# Altium project Dev_Brd_ATSAML10D16A.PrjPcb
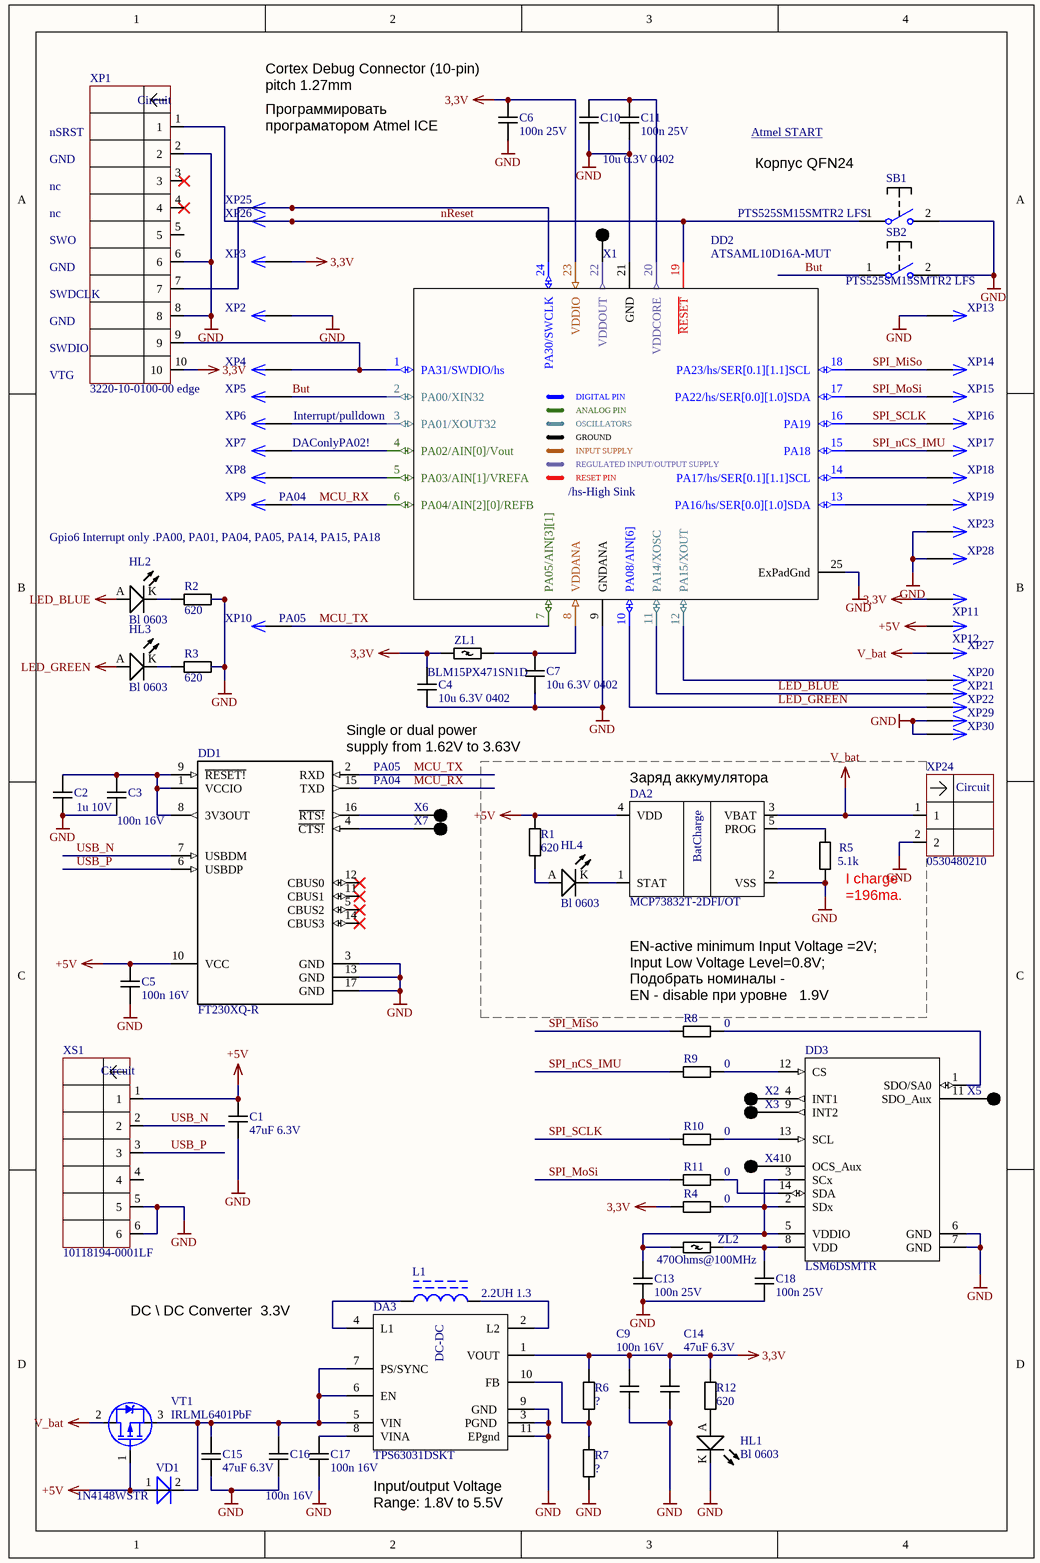
[diagram p0: Dev_Brd_ATSAML10D16A.SchDoc]
1 sheet, 82 parts. Net scope: global (net labels, ports and power ports of the same name join across sheets).
Board files: Dev_Brd_ATSAML10D16A.PcbDoc, Dev_Brd_ATSAML10D16A_HandMade.PcbDoc

## Sheet Dev_Brd_ATSAML10D16A.SchDoc
size A4 portrait; SheetNumber: 1; SheetTotal: 1

### Parts
C1  47uF 6.3V  [CapKemet1005(0402)]
C2  1u 10V  [CapKemet1005(0402)]
C3  100n 16V  [CapKemet1005(0402)]
C4  10u 6.3V 0402  [CapKemet1005(0402)]
C5  100n 16V  [CapKemet1005(0402)]
C6  100n 25V  [CapKemet1005(0402)]
C7  10u 6.3V 0402  [CapKemet1005(0402)]
C9  100n 16V  [CapKemet1005(0402)]
C10  10u 6.3V 0402  [CapKemet1005(0402)]
C11  100n 25V  [CapKemet1005(0402)]
C13  100n 25V  [CapKemet1005(0402)]
C14  47uF 6.3V  [CapKemet1005(0402)]
C15  47uF 6.3V  [CapKemet1005(0402)]
C16  100n 16V  [CapKemet1005(0402)]
C17  100n 16V  [CapKemet1005(0402)]
C18  100n 25V  [CapKemet1005(0402)]
DA2  MCP73832T-2DFI/OT  [SOT-23-5]
DA3  TPS63031DSKT  [WSON-10]
DD1  FT230XQ-R  [QFN-16(4x4)]
DD2  ATSAML10D16A-MUT  [VQFN-24]
DD3  LSM6DSMTR  [LGA-14L_2P5X3X0P83_STM-M]
HL1  Bl 0603  [LED-0603-BLUE]
HL2  Bl 0603  [LED-0603-BLUE]
HL3  Bl 0603  [LED-0603-BLUE]
HL4  Bl 0603  [LED-0603-BLUE]
L1  2.2UH 1.3  [CDRH2D11]
R1  620  [REZKemet 0402]
R2  620  [REZKemet 0402]
R3  620  [REZKemet 0402]
R4  0  [REZKemet 0402]
R5  5.1k  [REZKemet 0402]
R6  ?  [REZKemet 0402]
R7  ?  [REZKemet 0402]
R8  0  [REZKemet 0402]
R9  0  [REZKemet 0402]
R10  0  [REZKemet 0402]
R11  0  [REZKemet 0402]
R12  620  [REZKemet 0402]
SB1  PTS525SM15SMTR2 LFS  [TACT_SWITCH KPT1187B]
SB2  PTS525SM15SMTR2 LFS  [TACT_SWITCH KPT1187B]
VD1  1N4148WSTR  [SOD323]
VT1  IRLML6401PbF  [SOT23-3N]
X1  PLLS1.27-1-TOP-R  [PLLS1.27-1-TOP-R]  (value not drawn)
X2  PLLS1.27-1-TOP-R  [PLLS1.27-1-TOP-R]  (value not drawn)
X3  PLLS1.27-1-TOP-R  [PLLS1.27-1-TOP-R]  (value not drawn)
X4  PLLS1.27-1-TOP-R  [PLLS1.27-1-TOP-R]  (value not drawn)
X5  PLLS1.27-1-TOP-R  [PLLS1.27-1-TOP-R]  (value not drawn)
X6  PLLS1.27-1-TOP-R  [PLLS1.27-1-TOP-R]  (value not drawn)
X7  PLLS1.27-1-TOP-R  [PLLS1.27-1-TOP-R]  (value not drawn)
XP1  3220-10-0100-00 edge  [IPS 10(1.27)edge]
XP2  PLS-1  [PLS-1-3D]  (value not drawn)
XP3  PLS-1  [PLS-1-3D]  (value not drawn)
XP4  PLS-1  [PLS-1-3D]  (value not drawn)
XP5  PLS-1  [PLS-1-3D]  (value not drawn)
XP6  PLS-1  [PLS-1-3D]  (value not drawn)
XP7  PLS-1  [PLS-1-3D]  (value not drawn)
XP8  PLS-1  [PLS-1-3D]  (value not drawn)
XP9  PLS-1  [PLS-1-3D]  (value not drawn)
XP10  PLS-1  [PLS-1-3D]  (value not drawn)
XP11  PLS-1  [PLS-1-3D]  (value not drawn)
XP12  PLS-1  [PLS-1-3D]  (value not drawn)
XP13  PLS-1  [PLS-1-3D]  (value not drawn)
XP14  PLS-1  [PLS-1-3D]  (value not drawn)
XP15  PLS-1  [PLS-1-3D]  (value not drawn)
XP16  PLS-1  [PLS-1-3D]  (value not drawn)
XP17  PLS-1  [PLS-1-3D]  (value not drawn)
XP18  PLS-1  [PLS-1-3D]  (value not drawn)
XP19  PLS-1  [PLS-1-3D]  (value not drawn)
XP20  PLS-1  [PLS-1-3D]  (value not drawn)
XP21  PLS-1  [PLS-1-3D]  (value not drawn)
XP22  PLS-1  [PLS-1-3D]  (value not drawn)
XP23  PLS-1  [PLS-1-3D]  (value not drawn)
XP24  0530480210  [0530480210]
XP25  PLS-1  [PLS-1-3D]  (value not drawn)
XP26  PLS-1  [PLS-1-3D]  (value not drawn)
XP27  PLS-1  [PLS-1-3D]  (value not drawn)
XP28  PLS-1  [PLS-1-3D]  (value not drawn)
XP29  PLS-1  [PLS-1-3D]  (value not drawn)
XP30  PLS-1  [PLS-1-3D]  (value not drawn)
XS1  10118194-0001LF  [MICRO_USB _B]
ZL1  BLM15PX471SN1D  [Ferrite1005(0402)]
ZL2  470Ohms@100MHz  [Ferrite1005(0402)]

### Nets
3,3V: C4.2 C6.1 C9.2 C14.2 DA3.1(VOUT) DD2.23(VDDIO) R4.1 R6.2 R12.2 XP1.10 XP3.1 XP11.1 ZL1.1
+5V: C1.2 C5.2 DA2.4(VDD) DD1.10(VCC) R1.2 VD1.1 VT1.1(G) XP12.1 XS1.1
GND: C1.1 C2.1 C3.1 C4.1 C5.1 C6.2 C7.1 C9.1 C10.1 C11.2 C13.2 C14.1 C15.1 C16.1 C17.1 C18.2 DA2.2(VSS) DA3.3(PGND) DA3.9(GND) DA3.11(EPgnd) DD1.3(GND) DD1.13(GND) DD1.17(GND) DD2.9(GNDANA) DD2.21(GND) DD2.25(ExPadGnd) DD3.6(GND) DD3.7(GND) HL1.K R2.2 R3.2 R5.2 R7.1 SB1.2(NO) SB2.2(NO) XP1.2 XP1.6 XP1.8 XP2.1 XP13.1 XP23.1 XP24.2 XP28.1 XP29.1 XP30.1 XS1.5 XS1.6
LED_BLUE: DD2.11(PA14/XOSC) HL2.A XP21.1
LED_GREEN: DD2.10(PA08/AIN[6]) HL3.A XP22.1
V_bat: DA2.3(VBAT) VT1.2(D) XP24.1 XP27.1
But: DD2.2(PA00/XIN32) SB2.1(COMMON) XP5.1
MCU_RX: DD1.15(TXD) DD2.6(PA04/AIN[2][0]/REFB) XP9.1
MCU_TX: DD1.2(RXD) DD2.7(PA05/AIN[3][1]) XP10.1
nReset: DD2.19(~{RESET}) SB1.1(COMMON) XP1.1 XP26.1
SPI_MiSo: DD2.18(PA23/hs/SER[0.1][1.1]SCL) R8.1 XP14.1
SPI_MoSi: DD2.17(PA22/hs/SER[0.0][1.0]SDA) R11.1 XP15.1
SPI_nCS_IMU: DD2.15(PA18) R9.1 XP17.1
SPI_SCLK: DD2.16(PA19) R10.1 XP16.1
USB_N: DD1.7(USBDM) XS1.2
USB_P: DD1.6(USBDP) XS1.3
NetC2_2: C2.2 C3.2 DD1.1(VCCIO) DD1.8(3V3OUT) DD1.9(~{RESET!})
NetC7_2: C7.2 DD2.8(VDDANA) ZL1.2
NetC10_2: C10.2 C11.1 DD2.20(VDDCORE)
NetC13_1: C13.1 DD3.2(SDx) DD3.3(SCx) DD3.5(VDDIO) R4.2 ZL2.1
NetC15_2: C15.2 C16.2 DA3.5(VIN) DA3.6(EN) DA3.7(PS/SYNC) VD1.2 VT1.3(S)
NetC17_2: C17.2 DA3.8(VINA)
NetC18_1: C18.1 DD3.8(VDD) ZL2.2
NetDA2_1: DA2.1(STAT) HL4.K
NetDA2_5: DA2.5(PROG) R5.1
NetDA3_2: DA3.2(L2) L1.2
NetDA3_4: DA3.4(L1) L1.1
NetDA3_10: DA3.10(FB) R6.1 R7.2
NetDD1_4: DD1.4(~{CTS!}) X7.1
NetDD1_16: DD1.16(~{RTS!}) X6.1
NetDD2_1: DD2.1(PA31/SWDIO/hs) XP1.9 XP4.1
NetDD2_3: DD2.3(PA01/XOUT32) XP6.1
NetDD2_4: DD2.4(PA02/AIN[0]/Vout) XP7.1
NetDD2_5: DD2.5(PA03/AIN[1]/VREFA) XP8.1
NetDD2_12: DD2.12(PA15/XOUT) XP20.1
NetDD2_13: DD2.13(PA16/hs/SER[0.0][1.0]SDA) XP19.1
NetDD2_14: DD2.14(PA17/hs/SER[0.1][1.1]SCL) XP18.1
NetDD2_22: DD2.22(VDDOUT) X1.1
NetDD2_24: DD2.24(PA30/SWCLK) XP1.7 XP25.1
NetDD3_1: DD3.1(SDO/SA0) R8.2
NetDD3_4: DD3.4(INT1) X2.1
NetDD3_9: DD3.9(INT2) X3.1
NetDD3_10: DD3.10(OCS_Aux) X4.1
NetDD3_11: DD3.11(SDO_Aux) X5.1
NetDD3_12: DD3.12(CS) R9.2
NetDD3_13: DD3.13(SCL) R10.2
NetDD3_14: DD3.14(SDA) R11.2
NetHL1_A: HL1.A R12.1
NetHL2_K: HL2.K R2.1
NetHL3_K: HL3.K R3.1
NetHL4_A: HL4.A R1.1

Not connected (* = marked no-connect by the designer): DD1 5(CBUS2)* 11(CBUS1)* 12(CBUS0)* 14(CBUS3)*; XP1 3* 4* 5; XS1 4

### Notes on the sheet
- (near C6) Cortex Debug Connector (10-pin)
  pitch 1.27mm
- GND
- nSRST
- Программировать програматором Atmel ICE
- Atmel START <https://start.atmel.com/#dashboard>
- nc
- (near SB1) Корпус QFN24
- SWDCLK
- SWO
- SWDIO
- VTG
- Interrupt/pulldown
- PA04
- DAConlyPA02!
- (near DD2) Gpio6 Interrupt only .PA00, PA01, PA04, PA05, PA14, PA15, PA18
- (near XP10) PA05
- Single or dual power supply from 1.62V to 3.63V
- PA05
- (near DA2) Заряд аккумулятора
- I charge
  =196ma.
- (near R8) EN-active minimum Input Voltage =2V;
  Input Low Voltage Level=0.8V;
  Подобрать номиналы -
  EN - disable при уровне   1.9V
- DC \ DC Converter  3.3V
- PSM=0-ON
- Input/output Voltage Range: 1.8V to 5.5V
- (in symbol 3220-10-0100-00 edge) Circuit
- (in symbol 10118194-0001LF) Circuit
- (in symbol 0530480210) Circuit
- (in symbol ATSAML10D16A-MUT) DIGITAL PIN; ANALOG PIN; OSCILLATORS; GROUND; INPUT SUPPLY; REGULATED INPUT/OUTPUT SUPPLY; RESET PIN; /hs-High Sink
- (in symbol MCP73832T-2DFI/OT) BatCharge
- (in symbol TPS63031DSKT) DC-DC

### Library data of the parts
C1 C14 C15 = GRM188R60J476ME15D: CAP CER 47UF 6.3V X5R 0603; Part Number: GRM188R60J476ME15D; HelpURL: https://www.digikey.com/en/products/detail/murata-electronics/GRM188R60J476ME15D/5877410; Digi-Key Part Number: 490-13247-1-ND; Price$: 0.16924; Manufacturer Part Number: GRM188R60J476ME15D; Package: 0603
C2 = CAPC1005(0402)N: CAP CER 1UF 10V 10% X6S 0402; Manufacturer Part Number: LMK105BJ105KPLF; Part Number: CAPC1005(0402)N; HelpURL: https://eu.mouser.com/ProductDetail/Taiyo-Yuden/LMK105BJ105KPLF?qs=sGAEpiMZZMs0AnBnWHyRQIHQ3Mw87cdo1QzgwSlYWOQcjHYBR0FFrA%3D%3D; Price$: 0.11; Package: 0402; Mouser Part Number: 963-LMK105BJ105KPLF
C3 C5 C9 C16 C17 = CL05F104ZO5NNNC: Cap Cer 0.1uF 16V 1% C0G(NP0) MLCC; Part Number: CL05F104ZO5NNNC; HelpURL: https://www.digikey.com/product-detail/en/CL05F104ZO5NNNC/1276-1004-1-ND/3889090/?itemSeq=332907103; Digi-Key Part Number: 1276-1004-1-ND; Price$: 0.00475; Manufacturer Part Number: CL05F104ZO5NNNC; Package: 0402
C4 C7 C10 = CAPC1608(0603): CAP CER 10UF 6.3V X5R 0402; Manufacturer Part Number: GRJ155R60J106ME11D; Part Number: CAPC1608(0603); HelpURL: https://www.digikey.com/product-detail/en/murata-electronics-north-america/GRJ155R60J106ME11D/490-13211-1-ND/5877419; Digi-Key Part Number: GRJ155R60J106ME11D; Price$: 0.22; Code_JEDEC: 0402
C6 C11 = CAPC1608(0603): CAP CER 0.1UF 25V X5R 0402; Manufacturer Part Number: 885012105018; Part Number: CAPC1608(0603); Digi-Key Part Number: 732-7495-1-ND; HelpURL: https://www.digikey.com/product-detail/en/wurth-electronics-inc/885012105018/732-7495-1-ND/5454122; Price$: 0.11; Code_JEDEC: 0402
C13 C18 = CL05B104KA5NNNC: CAP CER 0.1UF 25V X7R 0402; Part Number: CL05B104KA5NNNC; Package: 0402; HelpURL: https://www.digikey.com/en/products/detail/samsung-electro-mechanics/CL05B104KA5NNNC/5961204; Digi-Key Part Number: 1276-6720-1-ND; Price$: 0.00487; Manufacturer Part Number: CL05B104KA5NNNC
DA2 = MCP73832T-2DFI/OT: IC LI-ION/LI-POLY CTRLR SOT23-5; Part Number: MCP73832T-2DFI/OT; HelpURL: https://www.digikey.com/product-detail/en/MCP73832T-2DFI%2fOT/MCP73832T-2DFI%2fOTCT-ND/2060344/?itemSeq=274027917; Digi-Key Part Number: MCP73832T-2DFI/OTCT-ND
DA3 = TPS63031DSKT: IC REG BCK BST 3.3V 900MA 10SON; Part Number: TPS63031DSKT; HelpURL: https://www.digikey.com/en/products/detail/texas-instruments/TPS63031DSKT/1967863; Price$: 2,28; Digi-Key Part Number: 296-23904-1-ND; Manufacturer Part Number: TPS63031DSKT
DD1 = FT230XQ-R: IC USB SERIAL BASIC UART 16QFN; Part Number: FT230XQ-R; HelpURL: https://www.digikey.com/en/products/detail/ftdi-future-technology-devices-international-ltd/FT230XQ-R/3029142; Price$: 2,04; Digi-Key Part Number: 768-1130-1-ND; Manufacturer Part Number: FT230XQ-R
DD2 = ATSAML10D16A-MUT: IC MCU 32BIT 64KB FLASH 24VQFN,ARM® Cortex®-M23; Part Number: ATSAML10D16A-MUT; HelpURL: https://www.digikey.com/product-detail/en/microchip-technology/ATSAML10D16A-MUT/ATSAML10D16A-MUTCT-ND/9360576; Price$: 1.82; Digi-Key Part Number: ATSAML10D16A-MUTCT-ND; Manufacturer Part Number: ATSAML10D16A-MUT; Code_JEDEC: VQFN-24
DD3 = LSM6DSMTR: IMU ACCEL/GYRO I2C/SPI 14LGA; SourceLibrary: Updates_to_database_2020-11-03; Built_By: EMA_Cory; Vendor: STMicroelectronics; HelpURL2: #https://www.digikey.com/product-detail/en/stmicroelectronics/LSM6DSMTR/497-16696-1-ND/6192778#; Datasheet: https://www.st.com/content/ccc/resource/technical/document/datasheet/76/27/cf/88/c5/03/42/6b/DM00218116.pdf/files/DM00218116.pdf/jcr:content/translations/en.DM00218116.pdf; Copyright: Copyright (C) 2018 Accelerated Designs. All rights reserved; Manufacturer_Part_Number: LSM6DSMTR; RefDes: RefDes; Type: DEV; Part Number: LSM6DSMTR; HelpURL: https://eu.mouser.com/ProductDetail/STMicroelectronics/LSM6DSMTR?qs=dTJS0cRn7ogKkf7uVmbVmg%3D%3D; Price$: 2.92; Digi-Key Part Number: 497-16696-1-ND; Manufacturer Part Number: LSM6DSMTR; Mouser Part Number: 511-LSM6DSMTR
HL1-HL4 = 150060BS55040: LED BLUE DIFFUSED 0603 SMD; Part Number: 150060BS55040; HelpURL: https://www.digikey.com/products/en?keywords=732-12013-1-ND; Digi-Key Part Number: 732-12013-1-ND; Manufacturer Part Number: 150060BS55040; Package: 0603
L1 = CDRH2D11/HPNP-2R2NC: FIXED IND 2.2UH 1.3A 120 MOHM; Published: 24-Mar-1999; LatestRevisionDate: 17-Jul-2002; LatestRevisionNote: Re-released for DXP Platform.; PackageReference: AXIAL-0.9; Publisher: Altium Limited; PackageDescription: Axial Device, Thru-Hole; 2 Leads; 0.9 in Pin Spacing; Part Number: CDRH2D11/HPNP-2R2NC; HelpURL: https://www.digikey.com/product-detail/en/sumida-america-components-inc/CDRH2D11-HPNP-2R2NC/308-1578-1-ND/2620850; Price$: 0.69; Digi-Key Part Number: 308-1578-1-ND; Manufacturer Part Number: CDRH2D11/HPNP-2R2NC
R1-R3 R6 R7 R12 = RESC1005(0402): Part Number: RESC1005(0402); Package: 0402
R4 R8-R11 = RMCF0402ZT0R00: RES SMD 0402 0 Ohm; Part Number: RMCF0402ZT0R00; HelpURL: https://www.digikey.com/en/products/detail/stackpole-electronics-inc/RMCF0402ZT0R00/1756905; Price$: 0.00186; Manufacturer Part Number: RMCF0402ZT0R00; Package: 0402; Mouser Part Number: RMCF0402ZT0R00CT-ND
R5 = RESC1005(0402): RES SMD 5.1K OHM 1% 1/10W 0402; Manufacturer Part Number: ERJ-2RKF5101X; Part Number: RESC1005(0402); HelpURL: https://eu.mouser.com/ProductDetail/ROHM-Semiconductor/SFR01MZPF5101?qs=sGAEpiMZZMvdGkrng054t7z4BkURc4Lz8VVRSaz2ejIiXEQeYNXBXw%3D%3D; Price$: 0.1; Package: 0402; Mouser Part Number: 755-SFR01MZPF5101
SB1 SB2 = PTS525SM15SMTR2 LFS: SWITCH TACTILE SPST-NO 0.02A 15V; Part Number: PTS525SM15SMTR2 LFS; HelpURL: https://www.digikey.com/products/en?keywords=CKN9104CT-ND; Digi-Key Part Number: CKN9104CT-ND; Price$: 0.33; Manufacturer Part Number: PTS525SM15SMTR2 LFS
VD1 = 1N4148WSTR: DIODE GEN PURP 75V 300MA SOD323; Published: 8-Jun-2000; LatestRevisionDate: 17-Jul-2002; LatestRevisionNote: Re-released for DXP Platform.; DatasheetVersion: 1997; PackageReference: DO-35; Publisher: Altium Limited; PackageDescription: Diode, Axial; Body 3.8 x 1.9 mm (LxDia. max), Lead Dia. 0.53 mm (max); Code_JEDEC: DO-204-AH; ComponentLink1Description: Manufacturer Link; ComponentLink1URL: http://www.fairchildsemi.com/; ComponentLink2Description: Datasheet; ComponentLink2URL: http://www.fairchildsemi.com/ds/1N%2F1N4148.pdf; Part Number: 1N4148WSTR; HelpURL: https://www.digikey.com/product-detail/en/smc-diode-solutions/1N4148WSTR/1655-1359-1-ND/6022804; Digi-Key Part Number: 1655-1359-1-ND; Price$: ?; Note: ?; Manufacturer Part Number: ?; Package: ?
VT1 = IRLML6401PbF: Note: ???; Part Number: IRLML6401PbF; HelpURL: https://www.infineon.com/dgdl/irlml6401pbf.pdf?fileId=5546d462533600a401535668b96d2634; Digi-Key Part Number: ???; Price$: ???; Manufacturer Part Number: ???; Package: ???
XP1 = 3220-10-0100-00 edge: 3220-10-0100-00; Part Number: 3220-10-0100-00 edge; HelpURL: https://www.digikey.com/product-detail/en/cnc-tech/3220-10-0100-00/1175-1627-ND/3883661; Digi-Key Part Number: 1175-1627-ND; Package: Header 20POS 1.27mm
XP2-XP23 XP25-XP30 = PLS-1: CONN HEADER VERT 1POS; Manufacturer Part Number: PRPC001SAAN-RC; Part Number: PLS-1; HelpURL: https://www.digikey.com/product-detail/en/sullins-connector-solutions/PRPC001SAAN-RC/S1011EC-01-ND/2775253; Digi-Key Part Number: S1011EC-01-ND; Price$: 0.05
XP24 = 0530480210: CONN HEADER R/A 2POS 1.25MM; Part Number: 0530480210; HelpURL: https://www.digikey.com/product-detail/en/molex/0530480210/WM1742-ND/242864; Digi-Key Part Number: WM1742-ND; Price$: 0.3; Manufacturer Part Number: 0530480210
XS1 = 10118194-0001LF: USB Connectors 5P MICRO USB TYPE B RCPT W/ REAR PEGS; Part Number: 10118194-0001LF; HelpURL: https://eu.mouser.com/ProductDetail/Amphenol-FCI/10118194-0001LF?qs=%2Fha2pyFadugHQYubHEjQrWaf71KglMlHbfZ%2FBmSxIoqAM0lAnkBayw%3D%3D; Digi-Key Part Number: 609-4618-1-ND; Price$: 0.265; Manufacturer Part Number: 10118194-0001LF; Mouser Part Number: 649-10118194-0001LF
ZL1 = Ferrite1005(0402): FERRITE BEAD 470 OHM 0402 1LN; Part Number: Ferrite1005(0402); Digi-Key Part Number: 490-10662-1-ND; Price$: 0.15; Manufacturer Part Number: BLM15PX471SN1D; Code_JEDEC: 0402
ZL2 = Ferrite1005(0402): FERRITE BEAD 470 OHM 0402 1LN; Manufacturer Part Number: BLM15PX471SN1D; Part Number: Ferrite1005(0402); Price$: 0.14; Package: 0402; HelpURL: https://eu.mouser.com/ProductDetail/Murata-Electronics/BLM15PX471SN1D?qs=%2Fha2pyFadugFXr5biOyskwIVnWnam4MScgU55pluOIVbLGfRcJswjw%3D%3D; Mouser Part Number: BLM15PX471SN1D
X1-X7 = PLLS1.27-1-TOP-R: Part Number: PLLS1.27-1-TOP-R